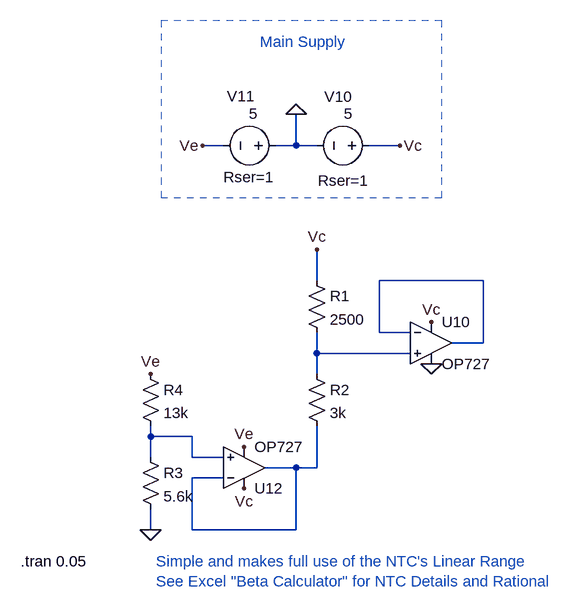
[diagram p0: schematic Temperature.asc]
Temperature.asc, the LTspice schematic file:
Version 4
SHEET 1 5396 1760
WIRE -1264 128 -1296 128
WIRE -1152 128 -1152 80
WIRE -1152 128 -1184 128
WIRE -1120 128 -1152 128
WIRE -992 128 -1040 128
WIRE -1120 336 -1120 288
WIRE -864 336 -1024 336
WIRE -1024 416 -1024 336
WIRE -976 416 -1024 416
WIRE -864 432 -864 336
WIRE -864 432 -912 432
WIRE -1120 448 -1120 416
WIRE -976 448 -1120 448
WIRE -1120 480 -1120 448
WIRE -1376 576 -1376 560
WIRE -1312 576 -1376 576
WIRE -1376 608 -1376 576
WIRE -1312 608 -1312 576
WIRE -1264 608 -1312 608
WIRE -1152 624 -1200 624
WIRE -1120 624 -1120 560
WIRE -1120 624 -1152 624
WIRE -1264 640 -1312 640
WIRE -1376 720 -1376 688
WIRE -1312 720 -1312 640
WIRE -1152 720 -1152 624
WIRE -1152 720 -1312 720
FLAG -1152 80 0
FLAG -1296 128 Ve
FLAG -992 128 Vc
FLAG -1232 592 Ve
FLAG -1232 656 Vc
FLAG -944 400 Vc
FLAG -944 464 0
FLAG -1120 288 Vc
FLAG -1376 720 0
FLAG -1376 480 Ve
SYMBOL voltage -1024 128 R90
WINDOW 123 0 0 Left 2
WINDOW 39 54 16 VRight 2
WINDOW 0 -75 42 VRight 2
WINDOW 3 -49 41 VRight 2
SYMATTR SpiceLine Rser=1
SYMATTR InstName V10
SYMATTR Value 5
SYMBOL voltage -1168 128 R90
WINDOW 123 0 0 Left 2
WINDOW 39 49 17 VRight 2
WINDOW 0 -76 48 VRight 2
WINDOW 3 -49 43 VRight 2
SYMATTR SpiceLine Rser=1
SYMATTR InstName V11
SYMATTR Value 5
SYMBOL Opamps\\OP727 -1232 688 M180
SYMATTR InstName U12
SYMBOL Opamps\\OP727 -944 368 R0
SYMATTR InstName U10
SYMBOL res -1136 320 R0
SYMATTR InstName R1
SYMATTR Value 2500
SYMBOL res -1136 464 R0
SYMATTR InstName R2
SYMATTR Value 3k
SYMBOL res -1392 592 R0
SYMATTR InstName R3
SYMATTR Value 5.6k
SYMBOL res -1392 464 R0
SYMATTR InstName R4
SYMATTR Value 13k
TEXT -1576 768 Left 2 !.tran 0.05
TEXT -1208 -32 Left 2 ;Main Supply
TEXT -1368 768 Left 2 ;Simple and makes full use of the NTC's Linear Range\nSee Excel "Beta Calculator" for NTC Details and Rational
RECTANGLE Normal -1360 208 -928 -64 2

The netlist it stands for:
* Temperature.asc
V10 Vc 0 5 Rser=1
V11 0 Ve 5 Rser=1
XU12 N003 N004 Vc Ve N004 OP727  ; pins In+ In- V+ V- OUT
XU10 N002 N001 Vc 0 N001 OP727  ; pins In+ In- V+ V- OUT
R1 Vc N002 2500
R2 N002 N004 3k
R3 N003 0 5.6k
R4 Ve N003 13k
.tran 0.05
* Main Supply
* Simple and makes full use of the NTC's Linear Range
* See Excel "Beta Calculator" for NTC Details and Rational
.backanno
.end